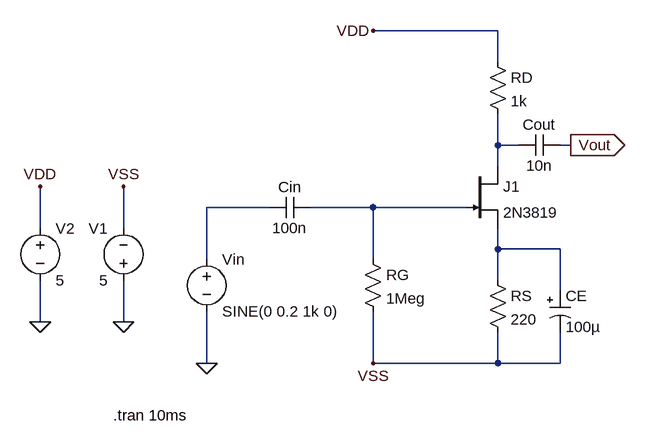
[diagram p0: schematic CS-JFET.asc]
CS-JFET.asc, the LTspice schematic file:
Version 4
SHEET 1 880 680
WIRE 448 64 256 64
WIRE 448 112 448 64
WIRE 448 240 448 192
WIRE 480 240 448 240
WIRE 560 240 544 240
WIRE 448 272 448 240
WIRE 96 336 0 336
WIRE 256 336 160 336
WIRE 400 336 256 336
WIRE -256 368 -256 304
WIRE -128 368 -128 304
WIRE 448 400 448 368
WIRE 544 400 448 400
WIRE 0 416 0 336
WIRE 256 416 256 336
WIRE 448 448 448 400
WIRE 544 464 544 400
WIRE -256 512 -256 448
WIRE -128 512 -128 448
WIRE 0 576 0 496
WIRE 256 576 256 496
WIRE 448 576 448 528
WIRE 448 576 256 576
WIRE 544 576 544 528
WIRE 544 576 448 576
FLAG 0 576 0
FLAG -256 512 0
FLAG -256 304 VDD
FLAG -128 512 0
FLAG -128 304 VSS
FLAG 256 576 VSS
FLAG 256 64 VDD
FLAG 560 240 Vout
IOPIN 560 240 Out
SYMBOL res 432 96 R0
SYMATTR InstName RD
SYMATTR Value 1k
SYMBOL voltage 0 400 R0
SYMATTR InstName Vin
SYMATTR Value SINE(0 0.2 1k 0)
SYMATTR Value2 AC 1
SYMBOL voltage -256 352 R0
SYMATTR InstName V2
SYMATTR Value 5
SYMBOL njf 400 272 R0
SYMATTR InstName J1
SYMATTR Value 2N3819
SYMBOL res 240 400 R0
SYMATTR InstName RG
SYMATTR Value 1Meg
SYMBOL cap 544 224 R90
WINDOW 0 0 32 VBottom 2
WINDOW 3 32 32 VTop 2
SYMATTR InstName Cout
SYMATTR Value 10n
SYMBOL res 432 432 R0
SYMATTR InstName RS
SYMATTR Value 220
SYMBOL cap 160 320 R90
WINDOW 0 0 32 VBottom 2
WINDOW 3 32 32 VTop 2
SYMATTR InstName Cin
SYMATTR Value 100n
SYMATTR SpiceLine Rpar=0.01
SYMBOL polcap 528 464 R0
SYMATTR InstName CE
SYMATTR Value 100µ
SYMBOL voltage -128 464 R180
WINDOW 0 24 96 Left 2
WINDOW 3 24 16 Left 2
SYMATTR InstName V1
SYMATTR Value 5
TEXT -144 656 Left 2 !.tran 10ms

The netlist it stands for:
* CS-JFET.asc
RD VDD N001 1k
Vin N002 0 SINE(0 0.2 1k 0) AC 1
V2 VDD 0 5
J1 N001 N003 N004 2N3819
RG N003 VSS 1Meg
Cout Vout N001 10n
RS N004 VSS 220
Cin N003 N002 100n Rpar=0.01
CE N004 VSS 100µ
V1 0 VSS 5
.model NJF NJF
.model PJF PJF
.lib standard.jft
.tran 10ms
.backanno
.end